# Altium schematic sheet 5_Compressor_Driver.schdoc
size 297 x 209 mm; Symbol: sucaimuban; Company: 嘉立创EDA; Version: V1.0; Page Size: A4; @Project Name: 26gsSucaiku; @Update Date: 2026-06-27; @Create Date: 2026-06-21; Device: sucaimuban; @Board Name: Sucaiku; @Page Name: Compressor_Driver; @Create Time: 21:33:40; @Page Count: 7; @Page No: 5; @Schematic Name: Schematic1; @Update Time: 20:42:32; @Assembly Variant: Basic; Border: 1; Title Block Position: 3; Size: A4; Width: 1170; Height: 825; Region Start: 1; X Region Count: 6; Y Region Count: 4; Blade Width: 10
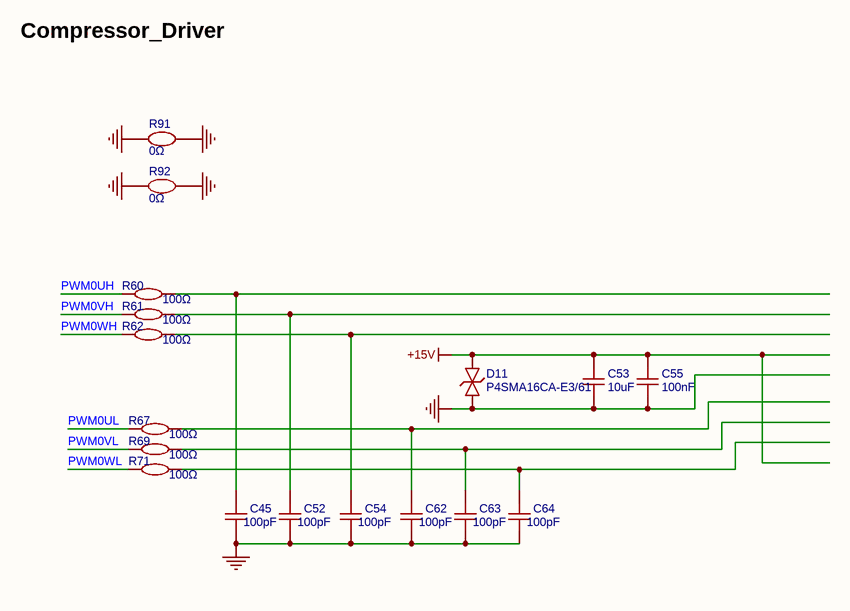
[diagram p0: 5_Compressor_Driver.schdoc]

## Parts
C45  100pF  [C0603]
C52  100pF  [C0603]
C53  10uF  [C1206]
C54  100pF  [C0603]
C55  100nF  [C0603]
C62  100pF  [C0603]
C63  100pF  [C0603]
C64  100pF  [C0603]
D11  P4SMA16CA-E3/61  [SMA_L4.3-W2.7-LS5.1-BI]
R60  100Ω  [R0603]
R61  100Ω  [R0603]
R62  100Ω  [R0603]
R67  100Ω  [R0603]
R69  100Ω  [R0603]
R71  100Ω  [R0603]
R91  0Ω  [R1206]
R92  0Ω  [R1206]

## Nets
+15V: C53.2 C55.1 D11.2
GND: C45.1 C52.1 C53.1 C54.1 C55.2 C62.1 C63.1 C64.1 D11.1 R91.1 R91.2 R92.1 R92.2
PWM0UH: R60.2
PWM0UL: R67.2
PWM0VH: R61.2
PWM0VL: R69.2
PWM0WH: R62.2
PWM0WL: R71.2
NetC45_2: C45.2 R60.1
NetC52_2: C52.2 R61.1
NetC54_2: C54.2 R62.1
NetC62_2: C62.2 R67.1
NetC63_2: C63.2 R69.1
NetC64_2: C64.2 R71.1

## Notes on the sheet
- Compressor_Driver
- 身份证号
- 选手姓名
- 手 机 号
- 图页名称
- 第                      幅
- 工程名称
- 共                    幅
- 当前日期
- 当前时间

## Library data of the parts
C45 C52 C54 C62-C64 = CC0603JRNPO9BN101: 容值:100pF;精度:±5%;额定电压:50V;温度系数:NP0;; Manufacturer: YAGEO(国巨); AddInBom: yes; ModelId: ac125912035d415993ca9572d50418b1聨0819f05c4eef4c71ace90d822a990e87; ModelName: C0603_L1.6-W0.8-H0.8; ModelTransform: 62.992,31.496,0,0,0,0,0,0,0; Tolerance: ±5%; Voltage Rating: 50V; Temperature Coefficient: NP0; Symbol: CC0603JRNPO9BN101; Device: CC0603JRNPO9BN101; LCSC Part Name: 100pF ±5% 50V; SupplierPart: C14665; ManufacturerPart: CC0603JRNPO9BN101; Supplier Footprint: 0603; JLCPCB Part Class: Extended Part; Datasheet: https://item.szlcsc.com/datasheet/CC0603JRNPO9BN101/15333.html; Supplier: LCSC; ConvertToPcb: yes; FootprintName: C0603; Value: 100pF
C53 = HGC1206R5106K500NSPJ: 容值:10uF;精度:±10%;额定电压:50V;温度系数:X5R;; Manufacturer: Chinocera(华瓷); AddInBom: yes; ModelId: e4be705b945545a48e666415e3682bd8聨0819f05c4eef4c71ace90d822a990e87; ModelName: C1206_L3.2-W1.6-H1.3; ModelTransform: 125.984,62.992,0,0,0,0,0,0,0; Tolerance: ±10%; Voltage Rating: 50V; Temperature Coefficient: X5R; Symbol: HGC1206R5106K500NSPJ; Device: HGC1206R5106K500NSPJ; LCSC Part Name: 10uF ±10% 50V; SupplierPart: C7432781; ManufacturerPart: HGC1206R5106K500NSPJ; Supplier Footprint: 1206; JLCPCB Part Class: Extended Part; Datasheet: https://item.szlcsc.com/datasheet/HGC1206R5106K500NSPJ/8438263.html; Supplier: LCSC; ConvertToPcb: yes; FootprintName: C1206; Value: 10uF
C55 = CL10B104KB8NNNC: 容值:100nF;精度:±10%;额定电压:50V;温度系数:X7R;; Manufacturer: SAMSUNG(三星); AddInBom: yes; ModelId: ac125912035d415993ca9572d50418b1聨0819f05c4eef4c71ace90d822a990e87; ModelName: C0603_L1.6-W0.8-H0.8; ModelTransform: 62.992,31.496,0,0,0,0,0,0,0; Tolerance: ±10%; Voltage Rating: 50V; Temperature Coefficient: X7R; Symbol: CL10B104KB8NNNC; Device: CL10B104KB8NNNC; LCSC Part Name: 100nF ±10% 50V; SupplierPart: C1591; ManufacturerPart: CL10B104KB8NNNC; Supplier Footprint: 0603; JLCPCB Part Class: Extended Part; Datasheet: https://item.szlcsc.com/datasheet/CL10B104KB8NNNC/1943.html; Supplier: LCSC; ConvertToPcb: yes; FootprintName: C0603; Value: 100nF
D11 = P4SMA16CA-E3/61: 极性:双向;反向截止电压(Vrwm):13.6V;钳位电压:22.5V;峰值脉冲电流(Ipp):17.8A;峰值脉冲功率(Ppp):400W@10/1000us;击穿电压:15.2V;; Manufacturer: VISHAY(威世); AddInBom: yes; ModelId: 1e67c61657434d61bdab16e34a20f5ac聨0819f05c4eef4c71ace90d822a990e87; ModelTransform: 200.787,106.299,0,0,0,0,0,0,0; Polarity: 双向; Reverse Stand-Off Voltage (Vrwm): 13.6V; Clamping Voltage: 22.5V; Peak Pulse Current (Ipp): 17.8A; Voltage - Breakdown: 15.2V; Reverse Leakage Current (Ir): 1uA; Type: TVS; Symbol: P4SMA16CA-E3/61; Device: P4SMA16CA-E3/61; LCSC Part Name: P4SMA16CA-E3/61; SupplierPart: C1974891; ManufacturerPart: P4SMA16CA-E3/61; Supplier Footprint: SMA(DO-214AC); JLCPCB Part Class: Extended Part; Datasheet: https://item.szlcsc.com/datasheet/P4SMA16CA-E3%252F61/2066429.html; Supplier: LCSC; ConvertToPcb: yes; FootprintName: SMA_L4.3-W2.7-LS5.1-BI; ModelName: SMA_L4.3-W2.7-LS5.1-BI; Peak Pulse Power Dissipation (Ppp): 400W@10/1000us; Operating Temperature: -65℃~+150℃
R60-R62 R67 R69 R71 = RC0603FR-07100RL: 电阻类型:厚膜电阻;阻值:100Ω;精度:±1%;功率:100mW;最大工作电压:75V;温度系数:±100ppm/℃;; Manufacturer: YAGEO(国巨); AddInBom: yes; ModelId: fc143cca1e79419f9cd78b61e9279f08聨0819f05c4eef4c71ace90d822a990e87; ModelTransform: 31.8897,63.7794,0,90,0,0,0,0,0; Tolerance: ±1%; Power(Watts): 100mW; Overload Voltage (Max): 75V; Symbol: RC0603FR-07100RL; Device: RC0603FR-07100RL; LCSC Part Name: 厚膜电阻 100Ω ±1% 100mW; SupplierPart: C105588; ManufacturerPart: RC0603FR-07100RL; Supplier Footprint: 0603; JLCPCB Part Class: Extended Part; Datasheet: https://atta.szlcsc.com/upload/public/pdf/source/20180316/70C0E2BDAE7FCC62C531A5A58D202EE1.pdf; Supplier: LCSC; ConvertToPcb: yes; FootprintName: R0603; ModelName: R0603; Type: 厚膜电阻; Value: 100Ω; Temperature Coefficient: ±100ppm/℃; Operating Temperature Range: -55℃~+155℃
R91 R92 = FRC1206P000 TS: 电阻类型:厚膜电阻;阻值:0Ω;精度:±5%;功率:250mW;工作电压:200V;; Manufacturer: FOJAN(富捷); AddInBom: yes; ModelId: 89a1f13db2384da588040e0b3c55bf66聨0819f05c4eef4c71ace90d822a990e87; ModelName: R1206_L3.2-W1.6-H0.6; ModelTransform: 125.984,62.992,0,0,0,0,0,0,0; Tolerance: ±5%; Power(Watts): 250mW; Voltage-Supply(Max): 200V; Symbol: FRC1206P000 TS; Device: FRC1206P000 TS; LCSC Part Name: 0Ω ±5% 250mW 厚膜电阻; SupplierPart: C2907406; ManufacturerPart: FRC1206P000 TS; Supplier Footprint: 1206; JLCPCB Part Class: Extended Part; Supplier: LCSC; ConvertToPcb: yes; FootprintName: R1206; Type: 厚膜电阻; Value: 0Ω; Operating Temperature: -55℃~+155℃